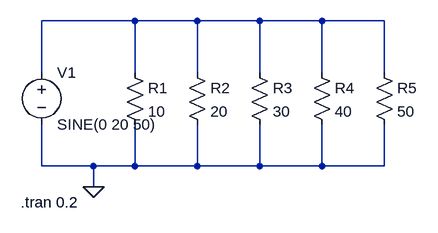
[diagram p0: schematic Basic Current Divider Circuit.asc]
Basic Current Divider Circuit.asc, the LTspice schematic file:
Version 4.1
SHEET 1 880 680
WIRE 128 64 -16 64
WIRE 224 64 128 64
WIRE 320 64 224 64
WIRE 416 64 320 64
WIRE 512 64 416 64
WIRE -16 144 -16 64
WIRE 128 144 128 64
WIRE 224 144 224 64
WIRE 320 144 320 64
WIRE 416 144 416 64
WIRE 512 144 512 64
WIRE -16 288 -16 224
WIRE 64 288 -16 288
WIRE 128 288 128 224
WIRE 128 288 64 288
WIRE 224 288 224 224
WIRE 224 288 128 288
WIRE 320 288 320 224
WIRE 320 288 224 288
WIRE 416 288 416 224
WIRE 416 288 320 288
WIRE 512 288 512 224
WIRE 512 288 416 288
WIRE 64 320 64 288
FLAG 64 320 0
SYMBOL voltage -16 128 R0
WINDOW 123 0 0 Left 0
WINDOW 39 0 0 Left 0
SYMATTR InstName V1
SYMATTR Value SINE(0 20 50)
SYMBOL res 112 128 R0
SYMATTR InstName R1
SYMATTR Value 10
SYMBOL res 208 128 R0
SYMATTR InstName R2
SYMATTR Value 20
SYMBOL res 304 128 R0
SYMATTR InstName R3
SYMATTR Value 30
SYMBOL res 400 128 R0
SYMATTR InstName R4
SYMATTR Value 40
SYMBOL res 496 128 R0
SYMATTR InstName R5
SYMATTR Value 50
TEXT -48 344 Left 2 !.tran 0.2

The netlist it stands for:
* Basic Current Divider Circuit.asc
V1 N001 0 SINE(0 20 50)
R1 N001 0 10
R2 N001 0 20
R3 N001 0 30
R4 N001 0 40
R5 N001 0 50
.tran 0.2
.backanno
.end